# Altium schematic sheet Brushless_driver_FOC_AbsoluteEncoder_V1.SchDoc
size A3
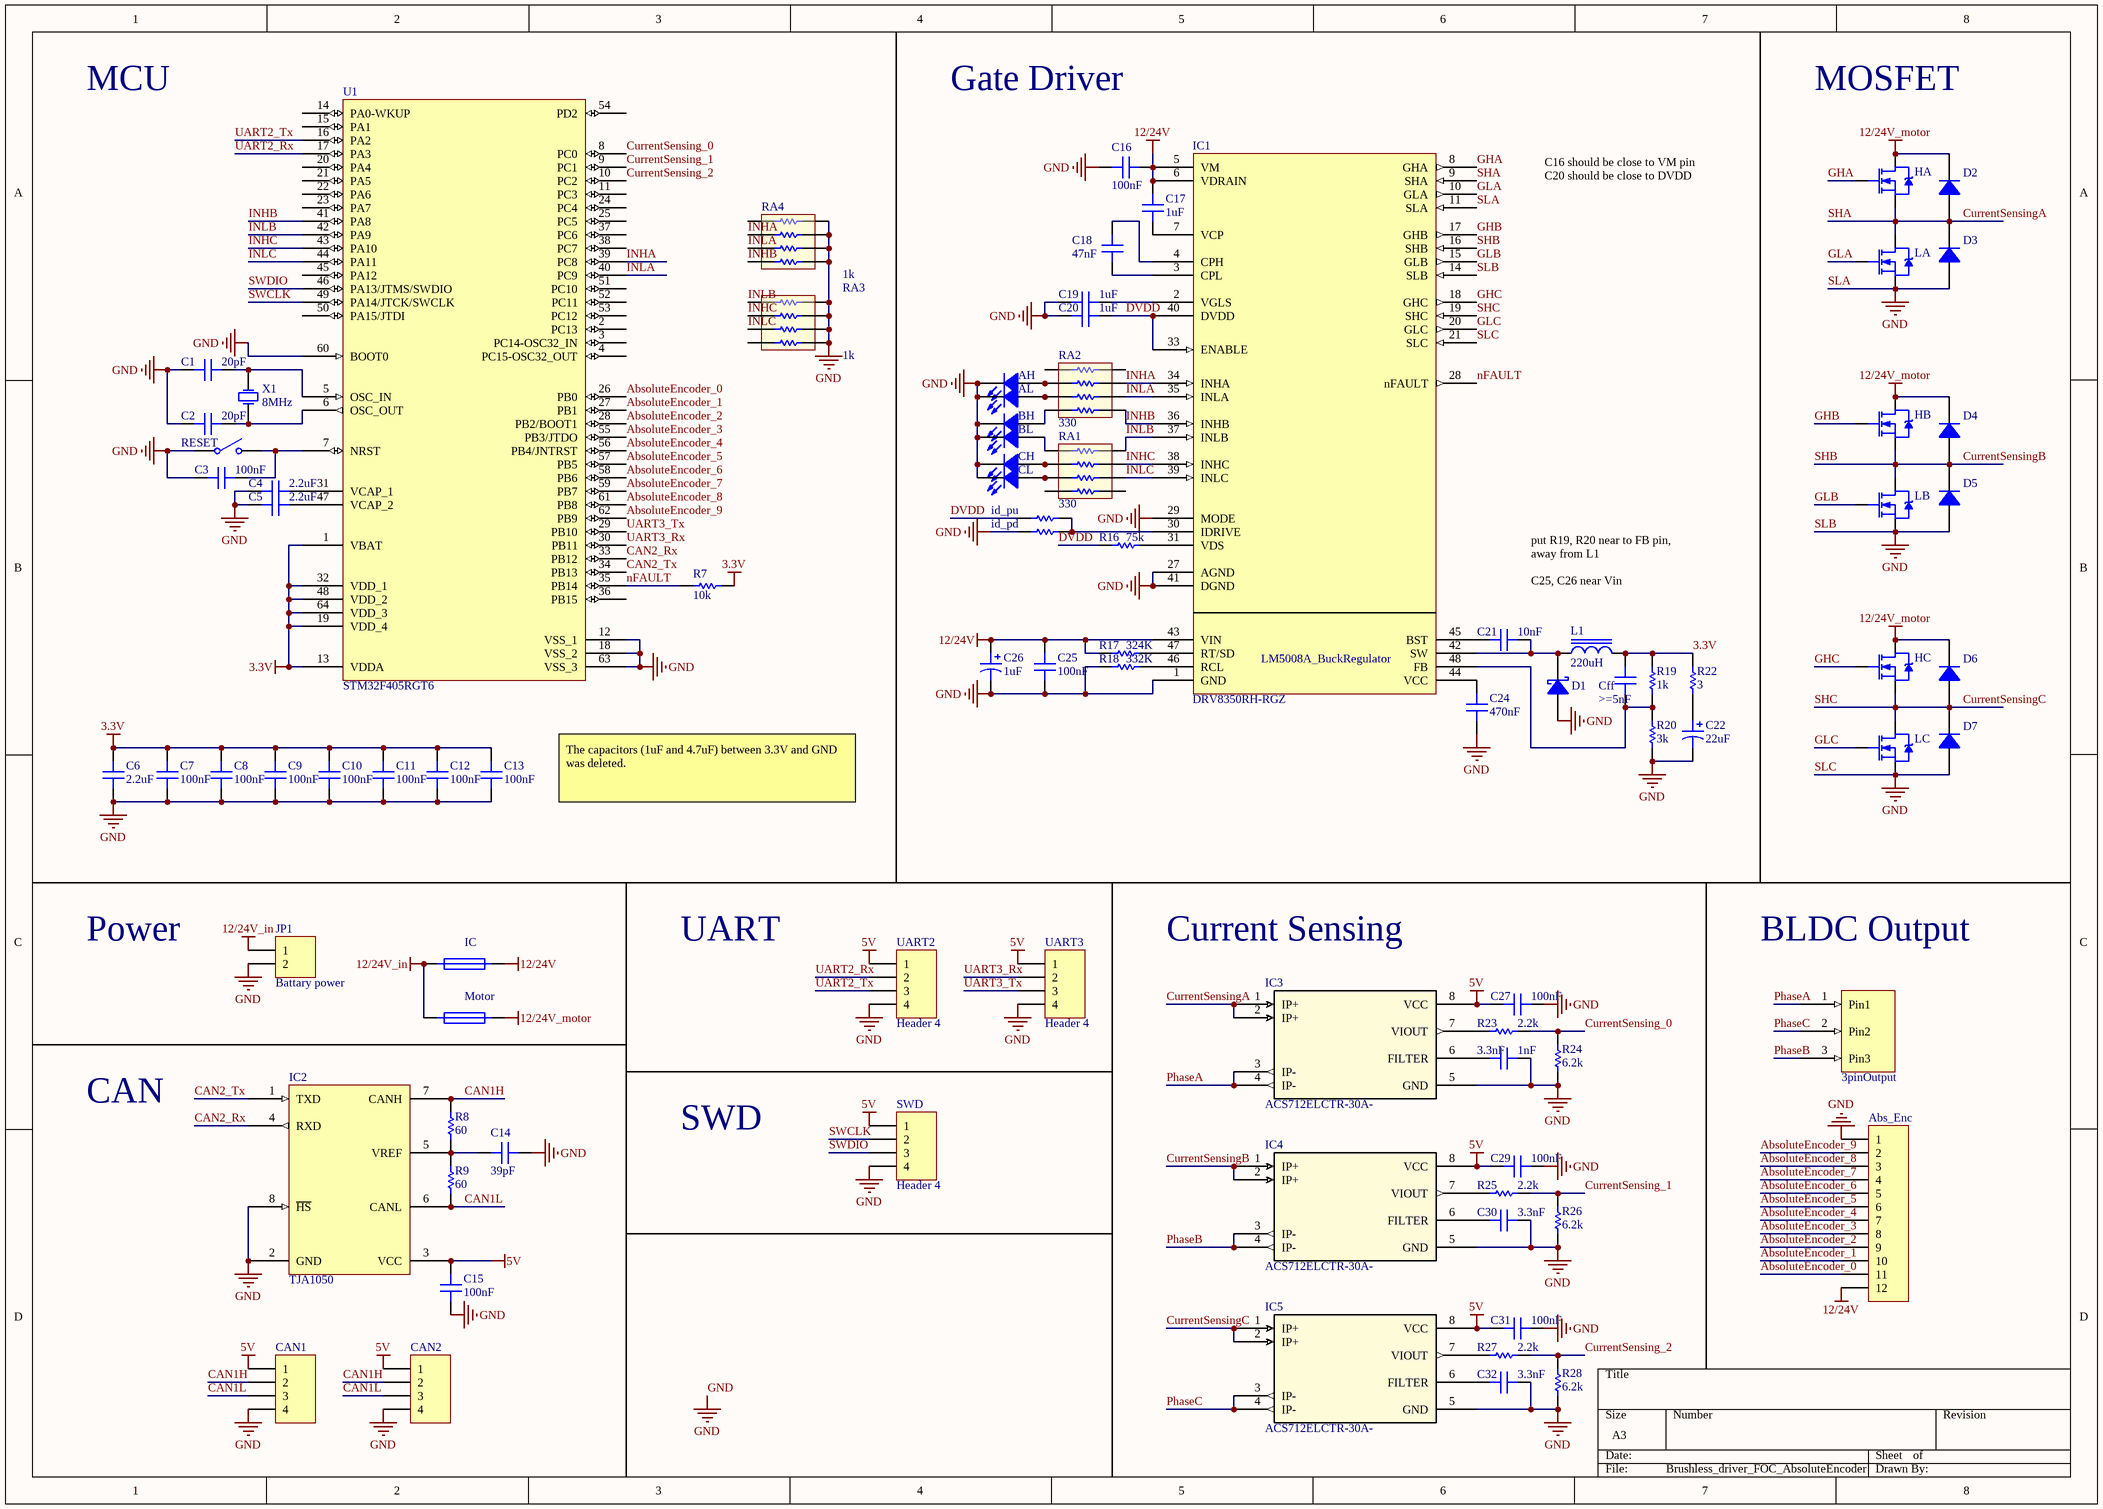
[diagram p0: Brushless_driver_FOC_AbsoluteEncoder_V1.SchDoc]

## Parts
3.3nF  1nF  [CC2012-0805]
?  3pinOutput  [3PinPowerOutput]
Abs_Enc  (no value)  [HDR1X12]
AH  (no value)  [D0805]
AL  (no value)  [D0805]
BH  (no value)  [D0805]
BL  (no value)  [D0805]
C1  20pF  [CC2012-0805]
C2  20pF  [CC2012-0805]
C3  100nF  [CC2012-0805]
C4  2.2uF  [CC2012-0805]
C5  2.2uF  [CC2012-0805]
C6  2.2uF  [CC2012-0805]
C7  100nF  [CC2012-0805]
C8  100nF  [CC2012-0805]
C9  100nF  [CC2012-0805]
C10  100nF  [CC2012-0805]
C11  100nF  [CC2012-0805]
C12  100nF  [CC2012-0805]
C13  100nF  [CC2012-0805]
C14  39pF  [CC2012-0805]
C15  100nF  [CC2012-0805]
C16  100nF  [CC2012-0805]
C17  1uF  [CC2012-0805]
C18  47nF  [CC2012-0805]
C19  1uF  [CC2012-0805]
C20  1uF  [CC2012-0805]
C21  10nF  [CC2012-0805]
C22  22uF  [CAPPR6.4X8]
C24  470nF  [CC2012-0805]
C25  100nF  [CC2012-0805]
C26  1uF  [CAPPR6.4X8]
C27  100nF  [CC2012-0805]
C29  100nF  [CC2012-0805]
C30  3.3nF  [CC2012-0805]
C31  100nF  [CC2012-0805]
C32  3.3nF  [CC2012-0805]
CAN1  (no value)  [LOCKEDHDR-4]
CAN2  (no value)  [LOCKEDHDR-4]
Cff  >=5nF  [CC2012-0805]
CH  (no value)  [D0805]
CL  (no value)  [D0805]
D1  (no value)  [SMC]
D2  (no value)  [SOD-80]
D3  (no value)  [SOD-80]
D4  (no value)  [SOD-80]
D5  (no value)  [SOD-80]
D6  (no value)  [SOD-80]
D7  (no value)  [SOD-80]
HA  (no value)  [TO-252AA]
HB  (no value)  [TO-252AA]
HC  (no value)  [TO-252AA]
IC  (no value)  [FUSE SOCKET]
IC1  DRV8350RH-RGZ  [DRV8350RH-RGZ_footprint]
IC2  TJA1050  [SOP-8]
IC3  ACS712ELCTR-30A-  [SOIC-8]
IC4  ACS712ELCTR-30A-  [SOIC-8]
IC5  ACS712ELCTR-30A-  [SOIC-8]
id_pd  (no value)  [CR2012-0805]
id_pu  (no value)  [CR2012-0805]
JP1  Battary power  [T-CONNECTOR(M)]
L1  220uH  [MSS1260]
LA  (no value)  [TO-252AA]
LB  (no value)  [TO-252AA]
LC  (no value)  [TO-252AA]
Motor  (no value)  [FUSE SOCKET]
R7  10k  [CR2012-0805]
R8  60  [CR2012-0805]
R9  60  [CR2012-0805]
R16  75k  [CR2012-0805]
R17  324K  [CR2012-0805]
R18  332K  [CR2012-0805]
R19  1k  [CR2012-0805]
R20  3k  [CR2012-0805]
R22  3  [CR2012-0805]
R23  2.2k  [CR2012-0805]
R24  6.2k  [CR2012-0805]
R25  2.2k  [CR2012-0805]
R26  6.2k  [CR2012-0805]
R27  2.2k  [CR2012-0805]
R28  6.2k  [CR2012-0805]
RA1  330  [ARC241-0603x4]
RA2  330  [ARC241-0603x4]
RA3  1k  [ARC241-0603x4]
RA4  1k  [ARC241-0603x4]
RESET  (no value)  [PUSH SWITCH]
SWD  Header 4  [LOCKEDHDR-4]
U1  STM32F405RGT6  [LQFP64]
UART2  Header 4  [LOCKEDHDR-4]
UART3  Header 4  [LOCKEDHDR-4]
X1  8MHz  [BCY-W2/E4.7]

## Nets
3.3V: C6.1 C7.1 C8.1 C9.1 C10.1 C11.1 C12.1 C13.1 Cff.1 L1.2 R7.2 R19.1 R22.2 U1.1(VBAT) U1.13(VDDA) U1.19(VDD_4) U1.32(VDD_1) U1.48(VDD_2) U1.64(VDD_3)
5V: C15.1 C27.1 C29.1 C31.1 CAN1.1 CAN2.1 IC2.3(VCC) IC3.8(VCC) IC4.8(VCC) IC5.8(VCC) SWD.1 UART2.1 UART3.1
12/24V: Abs_Enc.12 C16.2 C17.1 C25.1 C26.1 IC.2 IC1.5(VM) IC1.6(VDRAIN) IC1.43(VIN) R17.2
12/24V_in: IC.1 JP1.1 Motor.1
12/24V_motor: D2.2(K) D4.2(K) D6.2(K) HA.4(D) HB.4(D) HC.4(D) Motor.2
GND: 3.3nF.2 Abs_Enc.1 AH.2(K) AL.2(K) BH.2(K) BL.2(K) C1.1 C2.1 C3.1 C4.1 C5.1 C6.2 C7.2 C8.2 C9.2 C10.2 C11.2 C12.2 C13.2 C14.2 C15.2 C16.1 C19.2 C20.2 C22.2 C24.1 C25.2 C26.2 C27.2 C29.2 C30.2 C31.2 C32.2 CAN1.4 CAN2.4 CH.2(K) CL.2(K) D1.1(A) D3.1(A) D5.1(A) D7.1(A) IC1.1(GND) IC1.11(SLA) IC1.14(SLB) IC1.21(SLC) IC1.27(AGND) IC1.29(MODE) IC1.41(DGND) IC2.2(GND) IC2.8(~{HS}) IC3.5(GND) IC4.5(GND) IC5.5(GND) id_pd.1 JP1.2 LA.3(S) LB.3(S) LC.3(S) R18.1 R20.2 R24.1 R26.1 R28.1 RA3.2 RA3.4 RA3.6 RA3.8 RA4.2 RA4.4 RA4.6 RA4.8 RESET.1(COMMON) SWD.4 U1.12(VSS_1) U1.18(VSS_2) U1.60(BOOT0) U1.63(VSS_3) UART2.4 UART3.4  [also labelled SLA, SLB, SLC]
AbsoluteEncoder_0: Abs_Enc.11 U1.26(PB0)
AbsoluteEncoder_1: Abs_Enc.10 U1.27(PB1)
AbsoluteEncoder_2: Abs_Enc.9 U1.28(PB2/BOOT1)
AbsoluteEncoder_3: Abs_Enc.8 U1.55(PB3/JTDO)
AbsoluteEncoder_4: Abs_Enc.7 U1.56(PB4/JNTRST)
AbsoluteEncoder_5: Abs_Enc.6 U1.57(PB5)
AbsoluteEncoder_6: Abs_Enc.5 U1.58(PB6)
AbsoluteEncoder_7: Abs_Enc.4 U1.59(PB7)
AbsoluteEncoder_8: Abs_Enc.3 U1.61(PB8)
AbsoluteEncoder_9: Abs_Enc.2 U1.62(PB9)
CAN1H: CAN1.2 CAN2.2 IC2.7(CANH) R8.1
CAN1L: CAN1.3 CAN2.3 IC2.6(CANL) R9.1
CAN2_Rx: IC2.4(RXD) U1.33(PB12)
CAN2_Tx: IC2.1(TXD) U1.34(PB13)
CurrentSensing_0: R23.2 R24.2 U1.8(PC0)
CurrentSensing_1: R25.2 R26.2 U1.9(PC1)
CurrentSensing_2: R27.2 R28.2 U1.10(PC2)
CurrentSensingA: D2.1(A) D3.2(K) HA.3(S) IC1.9(SHA) IC3.1(IP+) IC3.2(IP+) LA.4(D)  [also labelled SHA]
CurrentSensingB: D4.1(A) D5.2(K) HB.3(S) IC1.16(SHB) IC4.1(IP+) IC4.2(IP+) LB.4(D)  [also labelled SHB]
CurrentSensingC: D6.1(A) D7.2(K) HC.3(S) IC1.19(SHC) IC5.1(IP+) IC5.2(IP+) LC.4(D)  [also labelled SHC]
DVDD: C20.1 IC1.33(ENABLE) IC1.40(DVDD) id_pu.1 R16.2
GHA: HA.1(G) IC1.8(GHA)
GHB: HB.1(G) IC1.17(GHB)
GHC: HC.1(G) IC1.18(GHC)
GLA: IC1.10(GLA) LA.1(G)
GLB: IC1.15(GLB) LB.1(G)
GLC: IC1.20(GLC) LC.1(G)
INHA: IC1.34(INHA) RA2.4 RA4.3 U1.39(PC8)
INHB: IC1.36(INHB) RA2.8 RA4.7 U1.41(PA8)
INHC: IC1.38(INHC) RA1.4 RA3.3 U1.43(PA10)
INLA: IC1.35(INLA) RA2.6 RA4.5 U1.40(PC9)
INLB: IC1.37(INLB) RA1.2 RA3.1 U1.42(PA9)
INLC: IC1.39(INLC) RA1.6 RA3.5 U1.44(PA11)
nFAULT: IC1.28(nFAULT) R7.1 U1.35(PB14)
PhaseA: ?.1(Pin1) IC3.3(IP-) IC3.4(IP-)
PhaseB: ?.3(Pin3) IC4.3(IP-) IC4.4(IP-)
PhaseC: ?.2(Pin2) IC5.3(IP-) IC5.4(IP-)
SWCLK: SWD.2 U1.49(PA14/JTCK/SWCLK)
SWDIO: SWD.3 U1.46(PA13/JTMS/SWDIO)
UART2_Rx: U1.17(PA3) UART2.2
UART2_Tx: U1.16(PA2) UART2.3
UART3_Rx: U1.30(PB11) UART3.2
UART3_Tx: U1.29(PB10) UART3.3
Net3.3nF_1: 3.3nF.1 IC3.6(FILTER)
NetAH_1: AH.1(A) RA2.3
NetAL_1: AL.1(A) RA2.5
NetBH_1: BH.1(A) RA2.7
NetBL_1: BL.1(A) RA1.1
NetC1_2: C1.2 U1.5(OSC_IN) X1.2(OSC2)
NetC2_2: C2.2 U1.6(OSC_OUT) X1.1(OSC1)
NetC3_2: C3.2 RESET.2(NO) U1.7(NRST)
NetC4_2: C4.2 U1.31(VCAP_1)
NetC5_2: C5.2 U1.47(VCAP_2)
NetC14_1: C14.1 IC2.5(VREF) R8.2 R9.2
NetC17_2: C17.2 IC1.7(VCP)
NetC18_1: C18.1 IC1.4(CPH)
NetC18_2: C18.2 IC1.3(CPL)
NetC19_1: C19.1 IC1.2(VGLS)
NetC21_1: C21.1 IC1.45(BST)
NetC21_2: C21.2 D1.2(K) IC1.42(SW) L1.1
NetC22_1: C22.1 R22.1
NetC24_2: C24.2 IC1.44(VCC)
NetC30_1: C30.1 IC4.6(FILTER)
NetC32_1: C32.1 IC5.6(FILTER)
NetCff_2: Cff.2 IC1.48(FB) R19.2 R20.1
NetCH_1: CH.1(A) RA1.3
NetCL_1: CL.1(A) RA1.5
NetIC1_30: IC1.30(IDRIVE) id_pd.2 id_pu.2
NetIC1_31: IC1.31(VDS) R16.1
NetIC1_46: IC1.46(RCL) R18.2
NetIC1_47: IC1.47(RT/SD) R17.1
NetIC3_7: IC3.7(VIOUT) R23.1
NetIC4_7: IC4.7(VIOUT) R25.1
NetIC5_7: IC5.7(VIOUT) R27.1

Not connected (* = marked no-connect by the designer): RA1 7 8; RA2 1 2; RA3 7; RA4 1; U1 2(PC13) 3(PC14-OSC32_IN) 4(PC15-OSC32_OUT) 11(PC3) 14(PA0-WKUP) 15(PA1) 20(PA4) 21(PA5) 22(PA6) 23(PA7) 24(PC4) 25(PC5) 36(PB15) 37(PC6) 38(PC7) 45(PA12) 50(PA15/JTDI) 51(PC10) 52(PC11) 53(PC12) 54(PD2)

## Notes on the sheet
- MCU
- Gate Driver
- MOSFET
- C16 should be close to VM pin
  C20 should be close to DVDD
- put R19, R20 near to FB pin, away from L1
  C25, C26 near Vin
  L1 near SW
- The capacitors (1uF and 4.7uF) between 3.3V and GND was deleted.
- Power
- UART
- Current Sensing
- BLDC Output
- CAN
- SWD
- (in symbol DRV8350RH-RGZ) LM5008A_BuckRegulator

## Library data of the parts
3.3nF C1-C21 C24 C25 C27 C29-C32 Cff = Cap Semi: Capacitor (Semiconductor SIM Model); Published: 8-Jun-2000; LatestRevisionDate: 17-Jul-2002; LatestRevisionNote: Re-released for DXP Platform.; PackageReference: C1206; Publisher: Altium Limited
Abs_Enc = Header 12: Header, 12-Pin; LatestRevisionDate: 17-Jul-2002; LatestRevisionNote: Re-released for DXP Platform.; Publisher: Altium Limited
AH AL BH BL CH CL = LED: Typical RED GaAs LED; Published: 8-Jun-2000; LatestRevisionDate: 08-Jul-2005; LatestRevisionNote: Mech Layer 1 removed.; PackageReference: LED-1; Publisher: Altium Limited
C22 C26 = Cap Pol DIP: Polarized Capacitor (Radial); Published: 8-Jun-2000; LatestRevisionDate: 17-Jul-2002; LatestRevisionNote: Re-released for DXP Platform.; Publisher: Altium Limited
CAN1 CAN2 SWD UART2 UART3 = Header 4: Header, 4-Pin; Revision: 17-Jul-2002: Re-released for DXP Platform.; Publisher: Altium Limited
D1 = D Schottky: Schottky Diode; Code - JEDEC: DO-214-AA; Published: 8-Jun-2000; Revision: July-2002: Re-released for DXP Platform.; Publisher: Altium Limited
D2-D7 = D General: General Purpose Diode; Revision 1: 11-Jul-2000: SIM Model Added.; Revision 2: 17-Jul-2002: Re-released for DXP Platform.; Code - JEDEC: DO-204-AH; Published: 8-Jun-2000; Datasheet: Latest Revision: 1997; Package Reference: DO-35; Publisher: Altium Limited
HA HB HC LA LB LC = IRLR3705: HEXFET N-Channel Power MOSFET; Note: Pin 2 is trimmed and is electrically connected to Drain.; Published: 8-Jun-2000; LatestRevisionDate: 17-Jul-2002; LatestRevisionNote: Re-released for DXP Platform.; DatasheetDocument: Nov-1998; PackageReference: TO-252AA; Publisher: Altium Limited; Code_JEDEC: TO-252-AA
IC Motor = Fuse: Revision: July-2002: Re-released for DXP Platform.; Publisher: Altium Limited
  Motor: Published: 8-Jun-2000
IC2 = TJA1050: 5V to 12V Charge Pump
IC3-IC5 = ACS712ELCTR-30A-: Imported; Manufacturer_Part_Number: ACS712ELCTR-30A-T; Vendor: Allegro Microsystems Inc.; Built_By: EMA_UL_Team; C: Copyright (C) 2015 Accelerated Designs. All rights reserved; RefDes: RefDes; Type: DEV; Value: Value
id_pd id_pu R7-R9 R16-R20 R22-R28 = Res Semi: Semiconductor Resistor; Published: 8-Jun-2000; LatestRevisionDate: 17-Jul-2002; LatestRevisionNote: Re-released for DXP Platform.; Publisher: Altium Limited
JP1 = Header 2: Header, 2-Pin; Revision: 17-Jul-2002: Re-released for DXP Platform.; Publisher: Altium Limited
L1 = Inductor: Value: 10uH; Published: 8-Jun-2000; Revision: July-2002: Re-released for DXP Platform.; Publisher: Altium Limited
RA1-RA4 = Res Array: 4x Resistor Array; Published: 8-Jun-2000; LatestRevisionDate: 17-Jul-2002; LatestRevisionNote: Re-released for DXP Platform.; Publisher: Altium Limited
RESET = SW-SPST: Single-Pole, Single-Throw Switch; Published: 24-Mar-1999; Revision: July-2002: Re-released for DXP Platform.; Publisher: Altium Limited
X1 = XTAL: Crystal Oscillator; Published: 8-Jun-2000; Revision: July-2002: Re-released for DXP Platform.; Publisher: Altium Limited